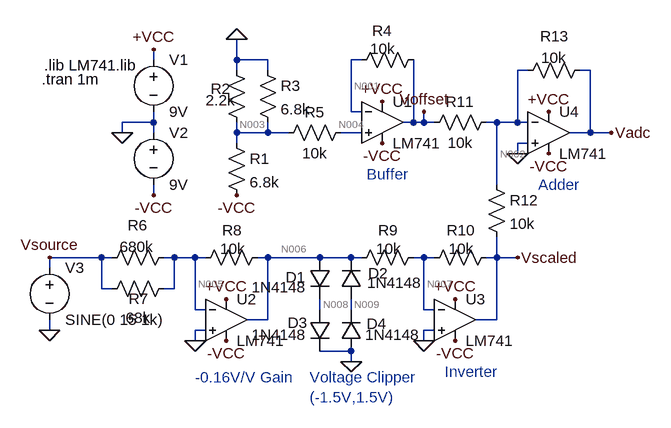
[diagram p0: schematic Draft1.asc]
Draft1.asc, the LTspice schematic file:
Version 4
SHEET 1 912 788
WIRE -112 192 -112 176
WIRE 16 192 16 160
WIRE 64 192 16 192
WIRE 208 192 192 192
WIRE 16 208 16 192
WIRE 64 208 64 192
WIRE 464 208 448 208
WIRE 560 208 544 208
WIRE 192 272 192 192
WIRE 208 272 192 272
WIRE -112 288 -112 272
WIRE -112 288 -160 288
WIRE 288 288 288 192
WIRE 288 288 272 288
WIRE 304 288 304 272
WIRE 304 288 288 288
WIRE 320 288 304 288
WIRE 416 288 400 288
WIRE 448 288 448 208
WIRE 448 288 416 288
WIRE 464 288 448 288
WIRE -160 304 -160 288
WIRE -112 304 -112 288
WIRE 16 304 16 288
WIRE 64 304 64 288
WIRE 64 304 16 304
WIRE 96 304 64 304
WIRE 208 304 176 304
WIRE 560 304 560 208
WIRE 560 304 528 304
WIRE 592 304 560 304
WIRE 16 320 16 304
WIRE 464 320 448 320
WIRE 448 336 448 320
WIRE 416 384 416 288
WIRE -112 400 -112 384
WIRE -192 496 -272 496
WIRE -176 496 -192 496
WIRE -80 496 -96 496
WIRE -48 496 -80 496
WIRE -32 496 -48 496
WIRE 64 496 48 496
WIRE 144 496 64 496
WIRE 192 496 144 496
WIRE 208 496 192 496
WIRE 304 496 288 496
WIRE 320 496 304 496
WIRE 416 496 416 464
WIRE 416 496 400 496
WIRE 448 496 416 496
WIRE -272 512 -272 496
WIRE -192 544 -192 496
WIRE -176 544 -192 544
WIRE -80 544 -80 496
WIRE -80 544 -96 544
WIRE -48 576 -48 496
WIRE -32 576 -48 576
WIRE 144 576 144 560
WIRE 192 576 192 560
WIRE 304 576 304 496
WIRE 320 576 304 576
WIRE 64 592 64 496
WIRE 64 592 32 592
WIRE 416 592 416 496
WIRE 416 592 384 592
WIRE -272 608 -272 592
WIRE -32 608 -48 608
WIRE 320 608 304 608
WIRE -48 624 -48 608
WIRE 304 624 304 608
WIRE 192 640 144 640
WIRE 192 656 192 640
FLAG -160 304 0
FLAG -112 176 +VCC
FLAG -112 400 -VCC
FLAG 16 160 0
FLAG 240 256 +VCC
FLAG 240 320 -VCC
FLAG -272 608 0
FLAG 0 560 +VCC
FLAG 0 624 -VCC
FLAG -272 496 Vsource
FLAG -48 624 0
FLAG 352 560 +VCC
FLAG 352 624 -VCC
FLAG 304 624 0
FLAG 496 272 +VCC
FLAG 496 336 -VCC
FLAG 592 304 Vadc
FLAG 448 336 0
FLAG 304 272 Voffset
FLAG 16 400 -VCC
FLAG 192 656 0
FLAG 448 496 Vscaled
SYMBOL voltage -112 176 R0
WINDOW 123 0 0 Left 0
WINDOW 39 0 0 Left 0
SYMATTR InstName V1
SYMATTR Value 9V
SYMBOL voltage -112 288 R0
WINDOW 123 0 0 Left 0
WINDOW 39 0 0 Left 0
SYMATTR InstName V2
SYMATTR Value 9V
SYMBOL res 0 304 R0
SYMATTR InstName R1
SYMATTR Value 6.8k
SYMBOL res 0 192 R0
WINDOW 0 -24 44 Left 2
WINDOW 3 -32 62 Left 2
SYMATTR InstName R2
SYMATTR Value 2.2k
SYMBOL res 48 192 R0
SYMATTR InstName R3
SYMATTR Value 6.8k
SYMBOL OpAmps\\opamp2 240 224 R0
SYMATTR InstName U1
SYMATTR Value LM741
SYMBOL res 304 176 R90
WINDOW 0 -13 64 VBottom 2
WINDOW 3 -17 63 VTop 2
SYMATTR InstName R4
SYMATTR Value 10k
SYMBOL res 192 288 R90
WINDOW 0 0 56 VBottom 2
WINDOW 3 32 56 VTop 2
SYMATTR InstName R5
SYMATTR Value 10k
SYMBOL voltage -272 496 R0
WINDOW 123 0 0 Left 0
WINDOW 39 0 0 Left 0
SYMATTR InstName V3
SYMATTR Value SINE(0 15 1k)
SYMBOL OpAmps\\opamp2 0 528 R0
SYMATTR InstName U2
SYMATTR Value LM741
SYMBOL res -80 480 R90
WINDOW 0 -18 56 VBottom 2
WINDOW 3 -16 58 VTop 2
SYMATTR InstName R6
SYMATTR Value 680k
SYMBOL res -80 528 R90
WINDOW 0 47 55 VBottom 2
WINDOW 3 45 55 VTop 2
SYMATTR InstName R7
SYMATTR Value 68k
SYMBOL res 64 480 R90
WINDOW 0 -10 55 VBottom 2
WINDOW 3 -13 54 VTop 2
SYMATTR InstName R8
SYMATTR Value 10k
SYMBOL OpAmps\\opamp2 352 528 R0
SYMATTR InstName U3
SYMATTR Value LM741
SYMBOL res 416 480 R90
WINDOW 0 -10 55 VBottom 2
WINDOW 3 -13 54 VTop 2
SYMATTR InstName R10
SYMATTR Value 10k
SYMBOL res 304 480 R90
WINDOW 0 -10 55 VBottom 2
WINDOW 3 -13 54 VTop 2
SYMATTR InstName R9
SYMATTR Value 10k
SYMBOL OpAmps\\opamp2 496 240 R0
SYMATTR InstName U4
SYMATTR Value LM741
SYMBOL res 304 304 R270
WINDOW 0 32 56 VTop 2
WINDOW 3 0 56 VBottom 2
SYMATTR InstName R11
SYMATTR Value 10k
SYMBOL res 400 368 R0
SYMATTR InstName R12
SYMATTR Value 10k
SYMBOL res 448 224 R270
WINDOW 0 53 57 VTop 2
WINDOW 3 51 56 VBottom 2
SYMATTR InstName R13
SYMATTR Value 10k
SYMBOL diode 160 496 M0
WINDOW 0 38 30 Left 2
WINDOW 3 36 46 Left 2
SYMATTR InstName D1
SYMATTR Value 1N4148
SYMBOL diode 176 560 M180
WINDOW 0 42 40 Left 2
WINDOW 3 41 25 Left 2
SYMATTR InstName D2
SYMATTR Value 1N4148
SYMBOL diode 160 576 M0
WINDOW 0 35 20 Left 2
WINDOW 3 36 39 Left 2
SYMATTR InstName D3
SYMATTR Value 1N4148
SYMBOL diode 176 640 M180
WINDOW 0 40 42 Left 2
WINDOW 3 38 25 Left 2
SYMATTR InstName D4
SYMATTR Value 1N4148
TEXT -284 222 Left 2 !.tran 1m
TEXT -280 200 Left 2 !.lib LM741.lib
TEXT 216 368 Left 2 ;Buffer
TEXT 480 384 Left 2 ;Adder
TEXT 128 680 Left 2 ;Voltage Clipper\n(-1.5V,1.5V)
TEXT -48 680 Left 2 ;-0.16V/V Gain
TEXT 336 672 Left 2 ;Inverter

The netlist it stands for:
* Draft1.asc
V1 +VCC 0 9V
V2 0 -VCC 9V
R1 N003 -VCC 6.8k
R2 0 N003 2.2k
R3 0 N003 6.8k
XU1 N004 N001 +VCC -VCC Voffset LM741  ; pins In+ In- V+ V- OUT
R4 Voffset N001 10k
R5 N004 N003 10k
V3 Vsource 0 SINE(0 15 1k)
XU2 0 N005 +VCC -VCC N006 LM741  ; pins In+ In- V+ V- OUT
R6 N005 Vsource 680k
R7 N005 Vsource 68k
R8 N006 N005 10k
XU3 0 N007 +VCC -VCC Vscaled LM741  ; pins In+ In- V+ V- OUT
R10 Vscaled N007 10k
R9 N007 N006 10k
XU4 0 N002 +VCC -VCC Vadc LM741  ; pins In+ In- V+ V- OUT
R11 Voffset N002 10k
R12 N002 Vscaled 10k
R13 N002 Vadc 10k
D1 N006 N008 1N4148
D2 N009 N006 1N4148
D3 N008 0 1N4148
D4 0 N009 1N4148
.model D D
.lib standard.dio
.tran 1m
.lib LM741.lib
* Buffer
* Adder
* Voltage Clipper
* (-1.5V,1.5V)
* -0.16V/V Gain
* Inverter
.backanno
.end

* Results of the author's LTspice run, read from the files saved beside the schematic
* Operating Point, zero values left out:
*   V(+vcc) = 9 V
*   V(-vcc) = -9 V
*   V(n003) = -1.768 V
*   V(n001) = -1.768 V
*   V(n004) = -1.769 V
*   V(voffset) = -1.767 V
*   V(n005) = 1 mV
*   V(n006) = 2.18 mV
*   V(n007) = 1 mV
*   V(vscaled) = 838.3 µV
*   V(n002) = 991 µV
*   V(vadc) = 1.77 V
*   V(n008) = 1.09 mV
*   V(n009) = 1.09 mV
*   I(D4) = -67.96 pA
*   I(D3) = 51.91 pA
*   I(D2) = -67.96 pA
*   I(D1) = 51.91 pA
*   I(R13) = -176.9 µA
*   I(R12) = 15.28 nA
*   I(R11) = -176.8 µA
*   I(R9) = -118 nA
*   I(R10) = -16.18 nA
*   I(R8) = 118 nA
*   I(R7) = 14.71 nA
*   I(R6) = 1.471 nA
*   I(R5) = -57.94 nA
*   I(R4) = 101.8 nA
*   I(R3) = 260 µA
*   I(R2) = 803.6 µA
*   I(R1) = 1.064 mA
*   I(V3) = 16.18 nA
*   I(V2) = -7.346 mA
*   I(V1) = -6.282 mA
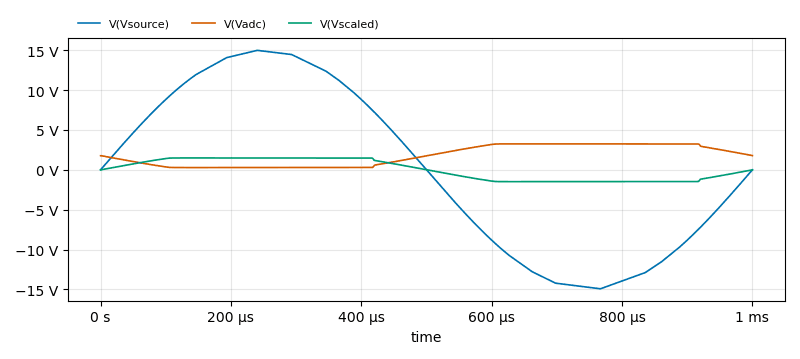
[diagram p1: Transient Analysis of Draft1.asc, plotted from the saved traces]
* Transient Analysis, 1 run:
*   V(Vsource): min -14.91 V, max 14.97 V, average 12.48 mV, rms 10.54 V, last 0 V
*   V(Vadc): min 282.6 mV, max 3.252 V, average 1.768 V, rms 2.18 V, last 1.785 V
*   V(Vscaled): min -1.482 V, max 1.488 V, average 2.103 mV, rms 1.274 V, last -7.294 mV